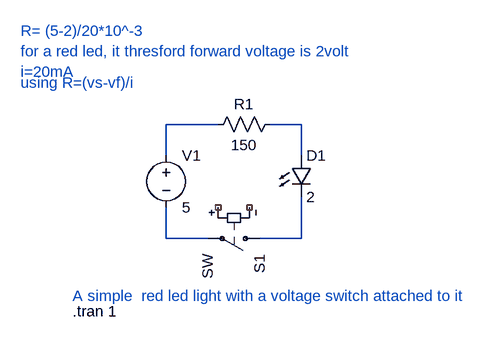
[diagram p0: schematic first ltspice.asc]
first ltspice.asc, the LTspice schematic file:
Version 4.1
SHEET 1 880 680
WIRE 48 -208 -32 -208
WIRE 176 -208 128 -208
WIRE -32 -160 -32 -208
WIRE 176 -160 176 -208
WIRE -32 -32 -32 -80
WIRE 32 -32 -32 -32
WIRE 176 -32 176 -96
WIRE 176 -32 112 -32
SYMBOL voltage -32 -176 R0
SYMATTR InstName V1
SYMATTR Value 5
SYMBOL LED 160 -160 R0
SYMATTR InstName D1
SYMATTR Value 2
SYMBOL res 144 -224 R90
WINDOW 0 0 56 VBottom 2
WINDOW 3 32 56 VTop 2
SYMATTR InstName R1
SYMATTR Value 150
SYMBOL sw 128 -32 R90
SYMATTR InstName S1
TEXT -176 56 Left 2 ;A simple  red led light with a voltage switch attached to it
TEXT -176 80 Left 2 !.tran 1
TEXT -256 -272 Left 2 ;using R=(vs-vf)/i
TEXT -256 -352 Left 2 ;R= (5-2)/20*10^-3        \nfor a red led, it thresford forward voltage is 2volt\ni=20mA

The netlist it stands for:
* first ltspice.asc
V1 N001 N003 5
D1 N002 N004 2
R1 N002 N001 150
S1 N004 N003 NC_01 NC_02 SW
.model D D
.lib standard.dio
* A simple  red led light with a voltage switch attached to it
.tran 1
* using R=(vs-vf)/i
* R= (5-2)/20*10^-3
* for a red led, it thresford forward voltage is 2volt
* i=20mA
.backanno
.end